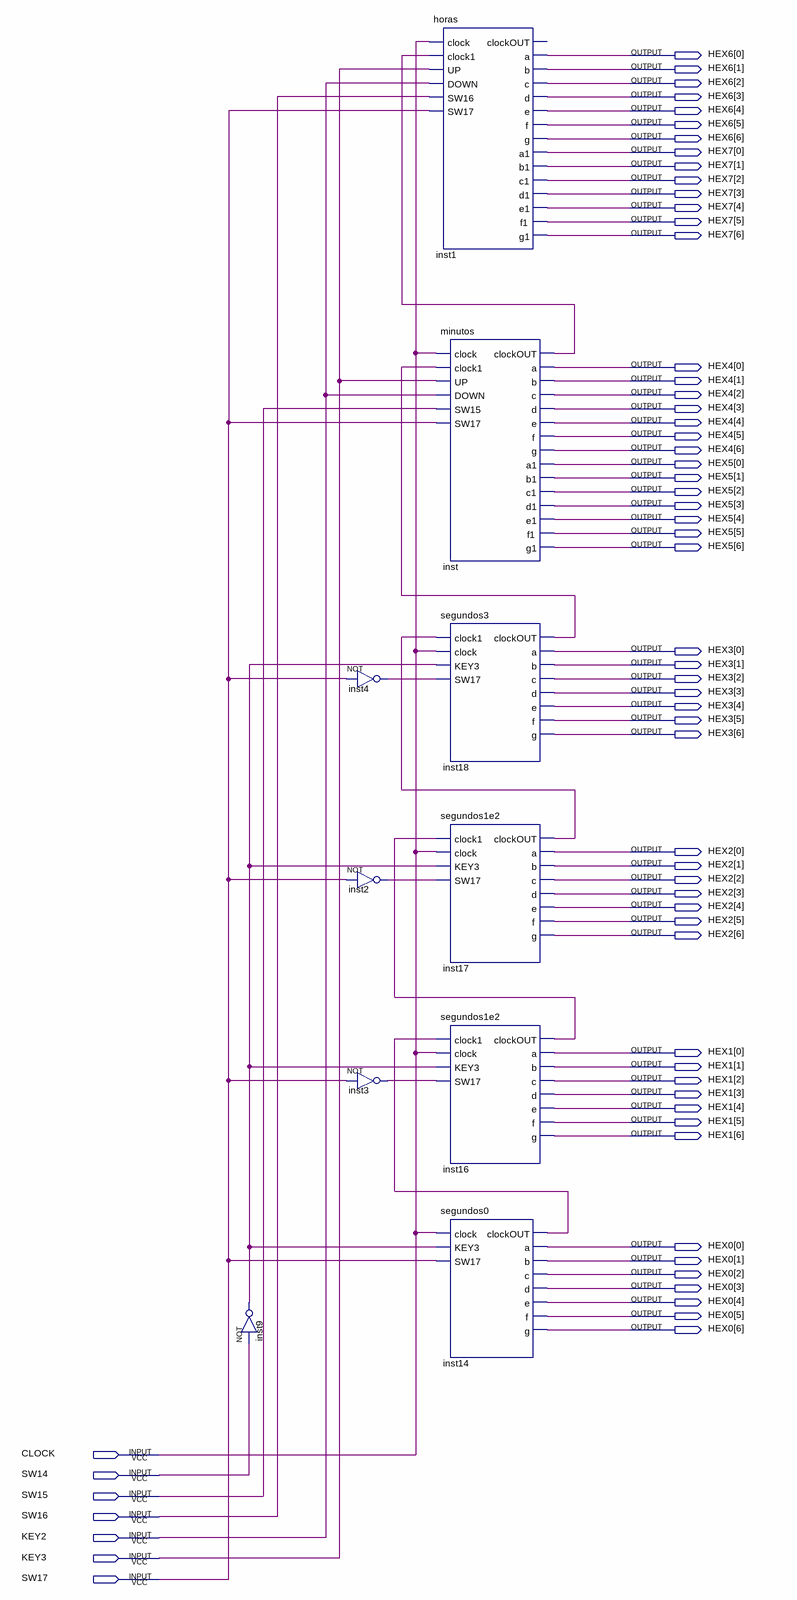
[diagram p0: schematic sheet]
// Quartus schematic RELOGIO.bdf as structural Verilog: 10 symbols, 63 pins
module RELOGIO (
  input  CLOCK,
  input  SW14,
  input  SW15,
  input  SW16,
  input  KEY2,
  input  KEY3,
  input  SW17,
  output [6:0] HEX6,
  output [6:0] HEX7,
  output [6:0] HEX4,
  output [6:0] HEX5,
  output [6:0] HEX3,
  output [6:0] HEX2,
  output [6:0] HEX1,
  output [6:0] HEX0
);

  wire inst2_out, inst3_out, inst4_out, inst9_out, inst14_clockout, inst16_clockout, inst17_clockout,
       inst18_clockout, inst_clockout;

  not inst9 (inst9_out, SW14);
  not inst4 (inst4_out, SW17);
  not inst2 (inst2_out, SW17);
  not inst3 (inst3_out, SW17);
  horas inst1 (
    .clock(CLOCK), .clock1(inst_clockout), .UP(KEY3), .DOWN(KEY2), .SW16(SW16), .SW17(SW17), .a(HEX6[0]),
    .b(HEX6[1]), .c(HEX6[2]), .d(HEX6[3]), .e(HEX6[4]), .f(HEX6[5]), .g(HEX6[6]), .a1(HEX7[0]), .b1(HEX7[1]),
    .c1(HEX7[2]), .d1(HEX7[3]), .e1(HEX7[4]), .f1(HEX7[5]), .g1(HEX7[6]));  // open: clockOUT
  minutos inst (
    .clock(CLOCK), .clock1(inst18_clockout), .UP(KEY3), .DOWN(KEY2), .SW15(SW15), .SW17(SW17),
    .clockOUT(inst_clockout), .a(HEX4[0]), .b(HEX4[1]), .c(HEX4[2]), .d(HEX4[3]), .e(HEX4[4]), .f(HEX4[5]),
    .g(HEX4[6]), .a1(HEX5[0]), .b1(HEX5[1]), .c1(HEX5[2]), .d1(HEX5[3]), .e1(HEX5[4]), .f1(HEX5[5]),
    .g1(HEX5[6]));
  segundos3 inst18 (
    .clock1(inst17_clockout), .clock(CLOCK), .KEY3(inst9_out), .SW17(inst4_out), .clockOUT(inst18_clockout),
    .a(HEX3[0]), .b(HEX3[1]), .c(HEX3[2]), .d(HEX3[3]), .e(HEX3[4]), .f(HEX3[5]), .g(HEX3[6]));
  segundos1e2 inst17 (
    .clock1(inst16_clockout), .clock(CLOCK), .KEY3(inst9_out), .SW17(inst2_out), .clockOUT(inst17_clockout),
    .a(HEX2[0]), .b(HEX2[1]), .c(HEX2[2]), .d(HEX2[3]), .e(HEX2[4]), .f(HEX2[5]), .g(HEX2[6]));
  segundos1e2 inst16 (
    .clock1(inst14_clockout), .clock(CLOCK), .KEY3(inst9_out), .SW17(inst3_out), .clockOUT(inst16_clockout),
    .a(HEX1[0]), .b(HEX1[1]), .c(HEX1[2]), .d(HEX1[3]), .e(HEX1[4]), .f(HEX1[5]), .g(HEX1[6]));
  segundos0 inst14 (
    .clock(CLOCK), .KEY3(inst9_out), .SW17(SW17), .clockOUT(inst14_clockout), .a(HEX0[0]), .b(HEX0[1]),
    .c(HEX0[2]), .d(HEX0[3]), .e(HEX0[4]), .f(HEX0[5]), .g(HEX0[6]));
endmodule
